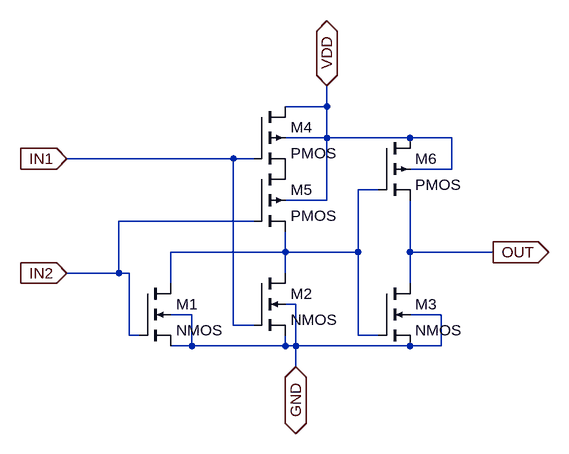
[diagram p0: schematic OR_OR.asc]
OR_OR.asc, the LTspice schematic file:
Version 4
SHEET 1 880 680
WIRE 256 -80 256 -112
WIRE 256 -80 192 -80
WIRE 256 -32 256 -80
WIRE 256 -32 192 -32
WIRE 384 -32 256 -32
WIRE 448 -32 384 -32
WIRE 112 0 -144 0
WIRE 144 0 112 0
WIRE 448 16 448 -32
WIRE 448 16 384 16
WIRE 336 48 304 48
WIRE 256 64 256 -32
WIRE 256 64 192 64
WIRE 144 96 -64 96
WIRE 192 144 192 112
WIRE 192 144 16 144
WIRE 304 144 304 48
WIRE 304 144 192 144
WIRE 384 144 384 64
WIRE 512 144 384 144
WIRE -64 176 -64 96
WIRE -64 176 -144 176
WIRE -48 176 -64 176
WIRE 192 176 192 144
WIRE 16 192 16 144
WIRE 384 192 384 144
WIRE 208 224 192 224
WIRE 48 240 16 240
WIRE 432 240 384 240
WIRE 112 256 112 0
WIRE 144 256 112 256
WIRE -48 272 -48 176
WIRE -32 272 -48 272
WIRE 304 272 304 144
WIRE 336 272 304 272
WIRE 48 288 48 240
WIRE 48 288 16 288
WIRE 192 288 192 272
WIRE 192 288 48 288
WIRE 208 288 208 224
WIRE 208 288 192 288
WIRE 384 288 208 288
WIRE 432 288 432 240
WIRE 432 288 384 288
WIRE 208 320 208 288
FLAG 208 320 GND
IOPIN 208 320 BiDir
FLAG 256 -112 VDD
IOPIN 256 -112 BiDir
FLAG 512 144 OUT
IOPIN 512 144 Out
FLAG -144 0 IN1
IOPIN -144 0 In
FLAG -144 176 IN2
IOPIN -144 176 In
SYMBOL nmos4 -32 192 R0
SYMATTR InstName M1
SYMATTR Value2 l=130n w=150n
SYMBOL nmos4 144 176 R0
SYMATTR InstName M2
SYMATTR Value2 l=130n w=150n
SYMBOL nmos4 336 192 R0
SYMATTR InstName M3
SYMATTR Value2 l=130n w=150n
SYMBOL pmos4 144 -80 R0
SYMATTR InstName M4
SYMATTR Value2 l=130n w=300n
SYMBOL pmos4 144 16 R0
SYMATTR InstName M5
SYMATTR Value2 l=130n w=300n
SYMBOL pmos4 336 -32 R0
SYMATTR InstName M6
SYMATTR Value2 l=130n w=300n

The netlist it stands for:
* OR_OR.asc
M1 N001 IN2 GND GND NMOS l=130n w=150n
M2 N001 IN1 GND GND NMOS l=130n w=150n
M3 OUT N001 GND GND NMOS l=130n w=150n
M4 VDD IN1 P001 VDD PMOS l=130n w=300n
M5 P001 IN2 N001 VDD PMOS l=130n w=300n
M6 VDD N001 OUT VDD PMOS l=130n w=300n
.model NMOS NMOS
.model PMOS PMOS
.lib standard.mos
.backanno
.end